# EAGLE design teensy (EAGLE 9.1.1)
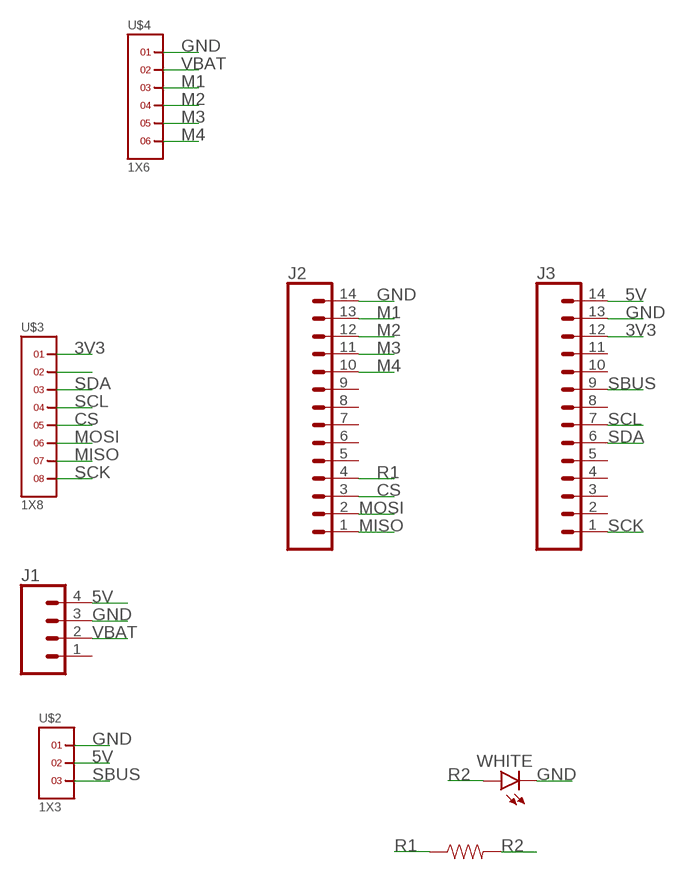
[diagram p0: schematic, sheet 1]

## Parts
D1  WHITE  LED-WHITE0603  [LED-0603]
J1  CONN_041X04_NO_SILK  [1X04_NO_SILK]
J2  CONN_14NO_SILK  [1X14_NO_SILK]
J3  CONN_14NO_SILK  [1X14_NO_SILK]
R1  22  22OHM-0603-1/10W-1%  [0603]
U$2  1X3  [1X3]
U$3  1X8  [1X8]
U$4  1X6  [1X6]

## Nets
3V3: J3.12 U$3.1
5V: J1.4 J3.14 U$2.2
CS: J2.3 U$3.5
GND: D1.C J1.3 J2.14 J3.13 U$2.1 U$3.2 U$4.1
M1: J2.13 U$4.3
M2: J2.12 U$4.4
M3: J2.11 U$4.5
M4: J2.10 U$4.6
MISO: J2.1 U$3.7
MOSI: J2.2 U$3.6
R1: J2.4 R1.1
R2: D1.A R1.2
SBUS: J3.9 U$2.3
SCK: J3.1 U$3.8
SCL: J3.7 U$3.4
SDA: J3.6 U$3.3
VBAT: J1.2 U$4.2
Unconnected: J1.1 J2.5 J2.6 J2.7 J2.8 J2.9 J3.2 J3.3 J3.4 J3.5 J3.8 J3.10 J3.11

## Library data of the parts
D1 = SparkFun-LED:LED-WHITE: White SMD LED Used in manufacturing several products at SparkFun. Packages: 0603 - Bright White SMD 0603 package[Product Link] <http://www.kingbrightusa.com/product.asp?catalog_name=LED&product_id=APT1608QWF/D> 1206 - Bright White SMD1206 package [Product Link] <http://www.kingbrightusa.com/product.asp?catalog_name=LED&product_id=APT3216QWF/D> 3014 - Super Bright SMD 3014 package [Datasheet] <http://www.lumileds.com/uploads/459/DS208-pdf> SparkFun Products: Blackberry Trackballer Breakout <https://www.sparkfun.com/products/13169> Digital SandBox <https://www.sparkfun.com/products/12651>; PROD_ID: DIO-09004
J1 = SparkFun-Connectors:CONN_04: Multi connection point. Often used as Generic Header-pin footprint for 0.1 inch spaced/style header connections On any of the 0.1 inch spaced packages, you can populate with these: Break Away Headers - Straight <https://www.sparkfun.com/products/116> (PRT-00116) Break Away Male Headers - Right Angle <https://www.sparkfun.com/products/553> (PRT-00553) Female Headers <https://www.sparkfun.com/products/115> (PRT-00115) Break Away Headers - Machine Pin <https://www.sparkfun.com/products/117> (PRT-00117) Break Away Female Headers - Swiss Machine Pin <https://www.sparkfun.com/products/743> (PRT-00743) For SCREWTERMINALS and SPRING TERMINALS visit here: Screw Terimnals on SparkFun.com <https://www.sparkfun.com/search/results?term=Screw+Terminals> (5mm/3.5mm/2.54mm spacing) This device is also useful as a general connection point to wire up your design to another part of your project. Our various solder wires solder well into these plated through hole pads. Hook-Up Wire - Assortment (Stranded, 22 AWG) <https://www.sparkfun.com/products/11375> (PRT-11375) Hook-Up Wire - Assortment (Solid Core, 22 AWG) <https://www.sparkfun.com/products/11367> (PRT-11367) View the entire wire category on our website here <https://www.sparkfun.com/categories/141> Special notes: Molex polarized connector foot print use with SKU : PRT-08231 with associated crimp pins and housings. 1MM SMD Version SKU: PRT-10208; PROD_ID: CONN-09696
J2 J3 = SparkFun-Connectors:CONN_14: Multi connection point. Often used as Generic Header-pin footprint for 0.1 inch spaced/style header connections On any of the 0.1 inch spaced packages, you can populate with these: Break Away Headers - Straight <https://www.sparkfun.com/products/116> (PRT-00116) Break Away Male Headers - Right Angle <https://www.sparkfun.com/products/553> (PRT-00553) Female Headers <https://www.sparkfun.com/products/115> (PRT-00115) Break Away Headers - Machine Pin <https://www.sparkfun.com/products/117> (PRT-00117) Break Away Female Headers - Swiss Machine Pin <https://www.sparkfun.com/products/743> (PRT-00743) For SCREWTERMINALS and SPRING TERMINALS visit here: Screw Terimnals on SparkFun.com <https://www.sparkfun.com/search/results?term=Screw+Terminals> (5mm/3.5mm/2.54mm spacing) This device is also useful as a general connection point to wire up your design to another part of your project. Our various solder wires solder well into these plated through hole pads. Hook-Up Wire - Assortment (Stranded, 22 AWG) <https://www.sparkfun.com/products/11375> (PRT-11375) Hook-Up Wire - Assortment (Solid Core, 22 AWG) <https://www.sparkfun.com/products/11367> (PRT-11367) View the entire wire category on our website here <https://www.sparkfun.com/categories/141> Special notes: Molex polarized connector foot print use with SKU : PRT-08231 with associated crimp pins and housings. 1MM SMD Version SKU: PRT-10208 NOTES ON THE VARIANTS LOCK and LOCK_LONGPADS... This footprint was designed to help hold the alignment of a through-hole component (i.e. 6-pin header) while soldering it into place. You may notice that each hole has been shifted either up or down by 0.005 of an inch from it's more standard position (which is a perfectly straight line). This slight alteration caused the pins (the squares in the middle) to touch the edges of the holes. Because they are alternating, it causes a "brace" to hold the component in place. 0.005 has proven to be the perfect amount of "off-center" position when using our standard breakaway headers. Although looks a little odd when you look at the bare footprint, once you have a header in there, the alteration is very hard to notice. Also,if you push a header all the way into place, it is covered up entirely on the bottom side.
R1 = SparkFun-Resistors:22OHM: 22Ω resistor A resistor is a passive two-terminal electrical component that implements electrical resistance as a circuit element. Resistors act to reduce current flow, and, at the same time, act to lower voltage levels within circuits. - Wikipedia; PROD_ID: RES-08698
U$2 = headers(2mm):1X3
U$3 = headers(2mm):1X8
U$4 = headers(2mm):1X6

## Board
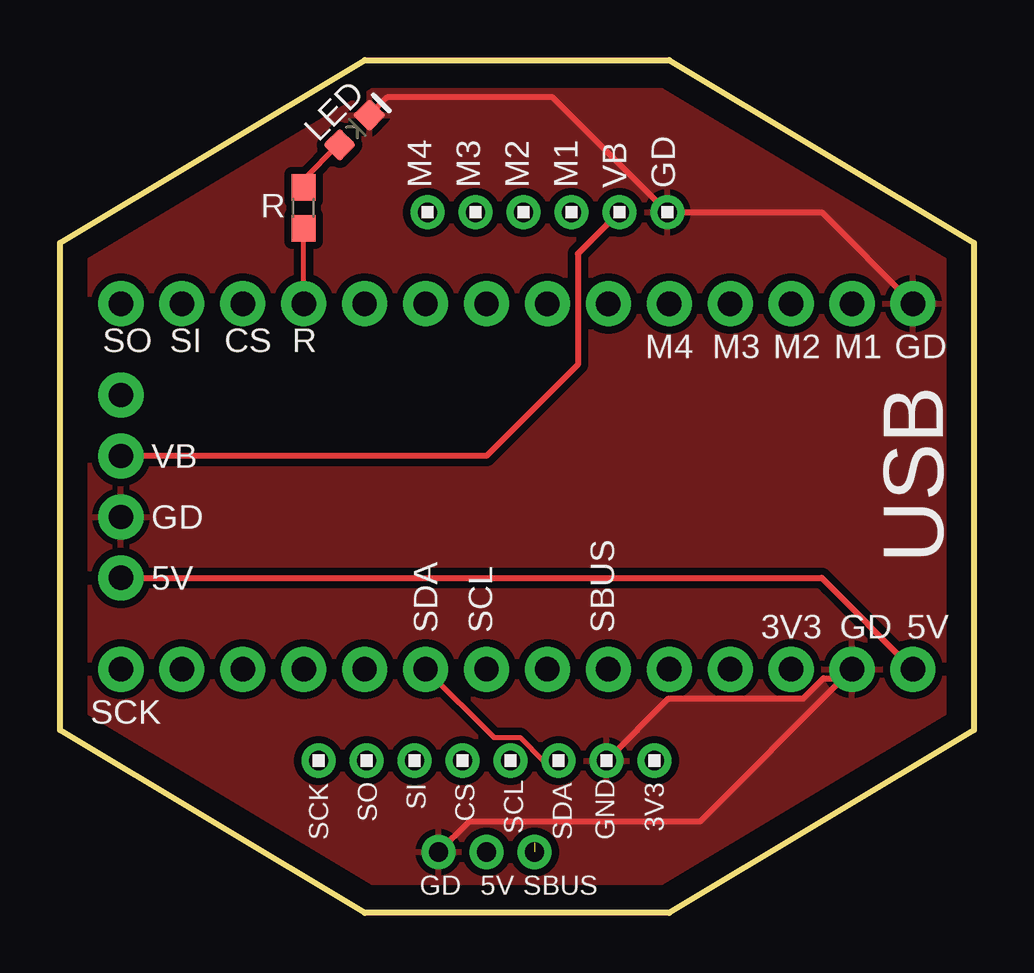
[diagram p1: board, top side]
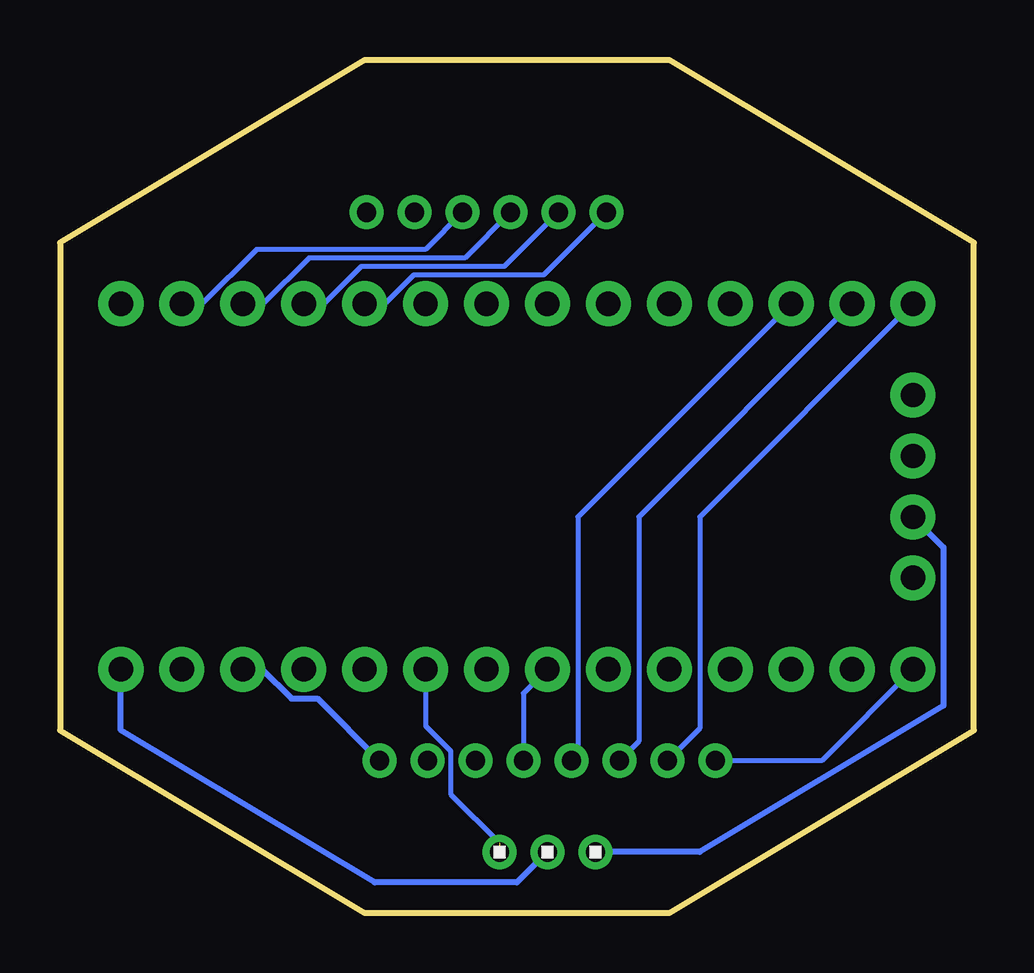
[diagram p2: board, bottom side, seen from below]

Size 38.1 x 35.56 mm. Coordinates in mm from the lower left corner, seen from the top.
Outline: 25.4,35.56 38.1,27.94 38.1,7.62 25.4,0 12.7,0 0,7.62 0,27.94 12.7,35.56 25.4,35.56
Copper layers (1*16): Top 0.035mm / dielectric 1.5mm / Bottom 0.035mm
Design rules "default": minimum track width 6mil, minimum drill 0.35mm, track to track 6mil, track to pad 6mil, pad to pad 6mil, via to via 6mil, smd to smd 6mil, copper to edge 40mil, drill to drill 6mil, minimum pad ring 10mil, minimum via ring 8mil, stop-mask expansion 4mil, vias tented up to drill 0mil, thermal gap 10mil

### Footprints (pad centres in the part's own frame; a part is rotated, then mirrored left to right if it is on the bottom)
LED-0603 = smd 1 x 1: A -0.877,0; C 0.877,0
1X04_NO_SILK = drill 1.016 pad 1.88: 1 0,0; 2 2.54,0; 3 5.08,0; 4 7.62,0
1X14_NO_SILK = drill 1.016 pad 1.88: 1 0,0; 2 2.54,0; 3 5.08,0; 4 7.62,0; 5 10.16,0; 6 12.7,0; 7 15.24,0; 8 17.78,0; 9 20.32,0; 10 22.86,0; 11 25.4,0; 12 27.94,0; 13 30.48,0; 14 33.02,0
0603 = smd 1.1 x 1: 1 -0.85,0; 2 0.85,0
1X3 = drill 0.8 pad 1.422: 1 -2,0; 2 0,0; 3 2,0
1X8 = drill 0.8 pad 1.422: 1 -7,0; 2 -5,0; 3 -3,0; 4 -1,0; 5 1,0; 6 3,0; 7 5,0; 8 7,0
1X6 = drill 0.8 pad 1.422: 1 -5,0; 2 -3,0; 3 -1,0; 4 1,0; 5 3,0; 6 5,0

### Placement (x,y rotation side)
D1  12.28,32.64 45 top
J1  2.54,21.59 270 top
J2  2.54,25.4 0 top
J3  2.54,10.16 0 top
R1  10.16,29.39 90 top
U$2  17.78,2.54 180 bottom
U$3  17.78,6.35 180 top
U$4  20.32,29.21 180 top

### Tracks (layer width: path | path; a pad name or v marks a point on that pad's centre or on a via)
3V3
  Bottom 0.254: J3.12 29.66,10.16 28.45,8.94 27.37,8.94 U$3.1
5V
  Top 0.254: J1.4 31.75,13.97 J3.14
  Bottom 0.254: U$2.2 19.05,1.27 24.98,1.27 35.56,7.62 J3.14
CS
  Bottom 0.203: J2.3 16.51,16.51 16.51,6.62 U$3.5
GND
  Top 0.254: J2.14 31.75,29.21 U$4.1 20.53,34 13.64,34 D1.C | J3.13 32.64,9.78 | 32.64,9.78 26.67,3.81 17.05,3.81 U$2.1 | U$3.2 25.37,8.94 30.98,8.94 31.82,9.78 32.64,9.78
  Bottom 0.254: J1.3 1.27,15.24 1.27,8.64 11.43,2.54 U$2.1
  pour Top (isolate 0.305): 0,0 0,35.56 38.1,35.56 38.1,0
M1
  Bottom 0.203: U$4.3 22.87,27.66 29.91,27.66 32.17,25.4 J2.13
M2
  Bottom 0.203: U$4.4 21.23,27.3 27.72,27.3 29.63,25.4 J2.12
M3
  Bottom 0.203: U$4.5 19.58,26.95 25.54,26.95 27.09,25.4 J2.11
M4
  Bottom 0.203: U$4.6 17.94,26.59 23.35,26.59 24.55,25.4 J2.10
MISO
  Bottom 0.203: J2.1 11.43,16.51 11.43,7.7 U$3.7
MOSI
  Bottom 0.203: J2.2 13.97,16.51 13.97,7.16 U$3.6
R1
  Top 0.203: J2.4 R1.1
R2
  Top 0.203: D1.A 11.6,32.02 10.11,30.53 10.11,30.29 R1.2
SBUS  (1 unrouted)
  Bottom 0.203: J3.9 22.86,7.79 21.82,6.75 21.82,4.96 19.78,2.92
SCK
  Bottom 0.203: J3.1 6.35,6.35 U$3.8
SCL
  Bottom 0.203: J3.7 18.78,9.16 U$3.4
SDA
  Top 0.203: J3.6 18.09,7.32 19.18,7.32 20.14,6.35 U$3.3
VBAT
  Top 0.254: U$4.2 21.59,27.48 21.59,22.86 17.78,19.05 J1.2

### Text on the board
tPlace: USB
tNames: LED | M4 | M3 | M2 | M1 | VB | GD | R | SO | SI | CS | R | M4 | M3 | M2 | M1 | GD | VB | GD | 5V | SDA | SCL | SBUS | 3V3 | GD | 5V | SCK | SO | SI | CS | SCK | SCL | SDA | GND | 3V3 | GD | 5V | SBUS